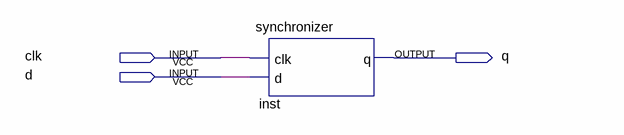
[diagram p0: schematic sheet]
// Quartus schematic synchronizer_test.bdf as structural Verilog: 1 symbols, 3 pins
module synchronizer_test (
  input  clk,
  input  d,
  output q
);

  synchronizer inst (.clk(clk), .d(d), .q(q));
endmodule
